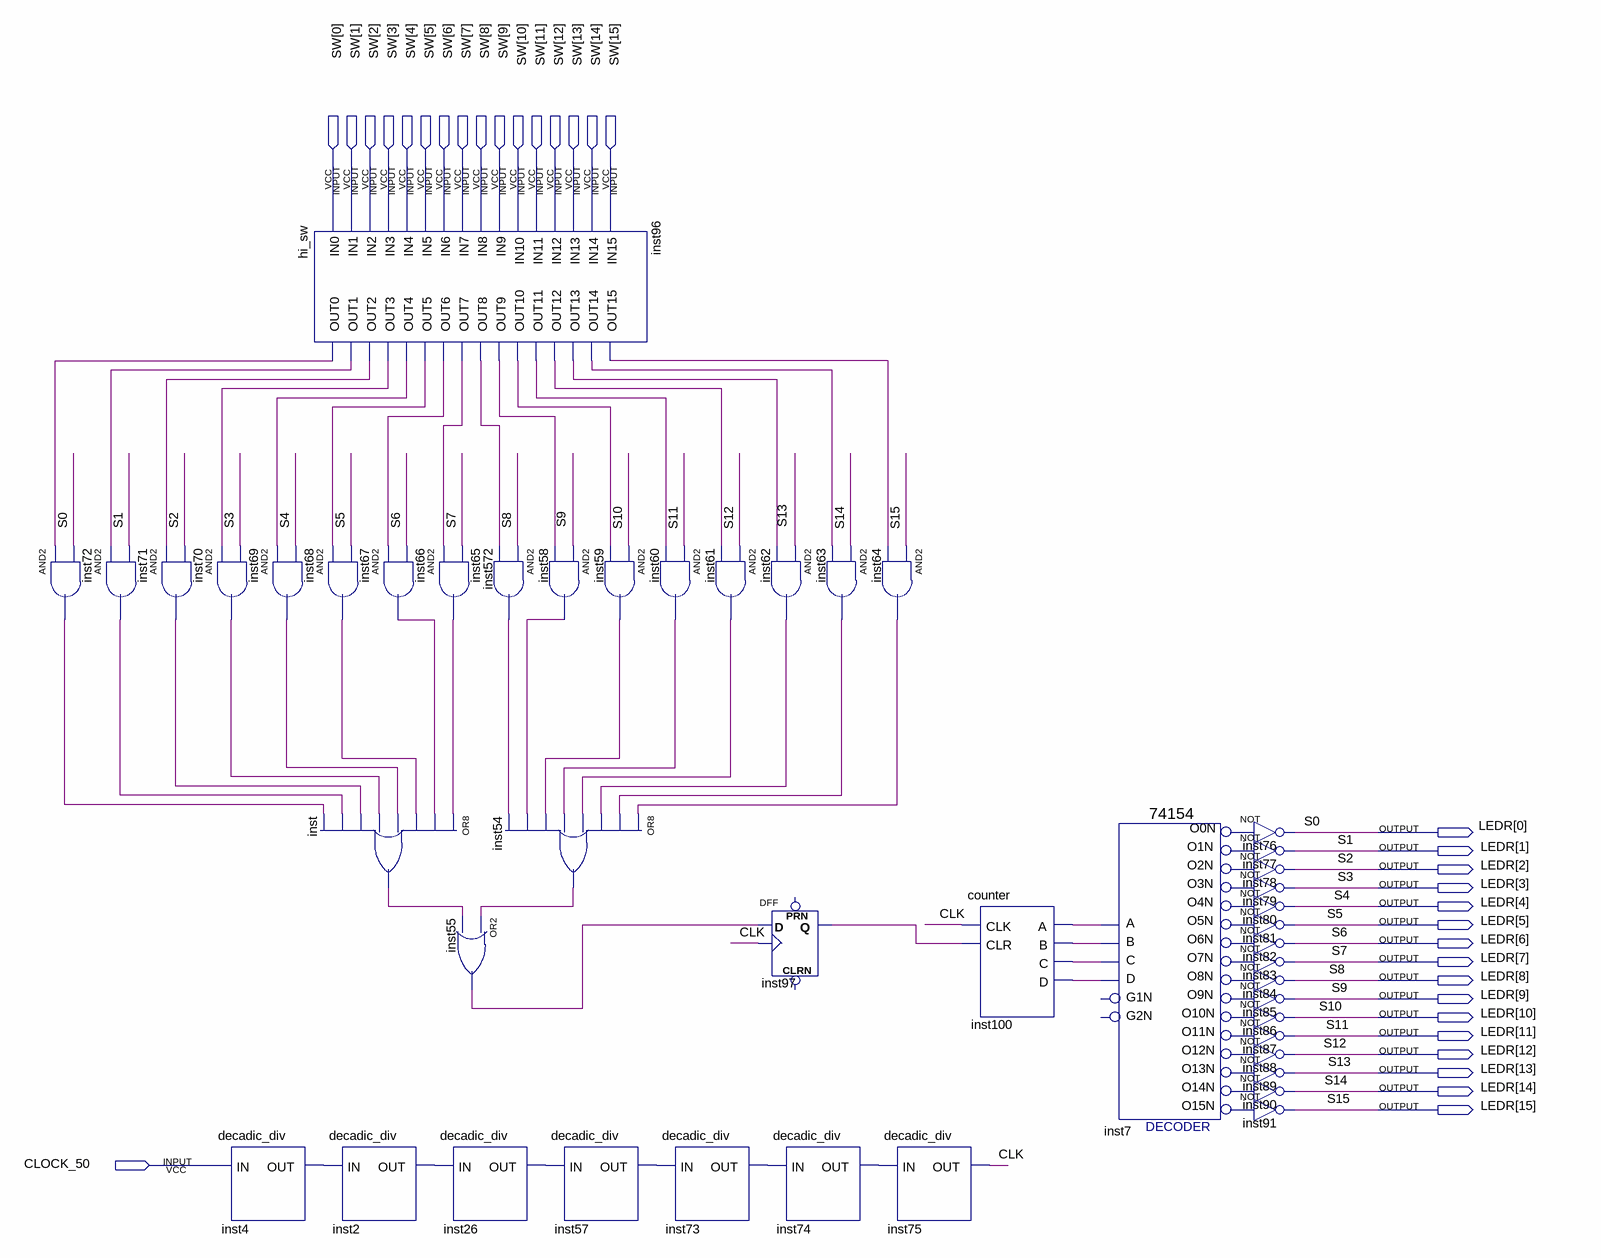
[diagram p0: schematic sheet]
// Quartus schematic had.bdf as structural Verilog: 46 symbols, 33 pins
module had (
  input  [15:0] SW,
  input  CLOCK_50,
  output [15:0] LEDR
);

  wire CLK, inst2_out, inst4_out, inst7_o0n, inst7_o1n, inst7_o2n, inst7_o3n, inst7_o4n, inst7_o5n,
       inst7_o6n, inst7_o7n, inst7_o8n, inst7_o9n, inst7_o10n, inst7_o11n, inst7_o12n, inst7_o13n,
       inst7_o14n, inst7_o15n, inst26_out, inst54_out, inst55_out, inst57_out, inst58_out, inst59_out,
       inst60_out, inst61_out, inst62_out, inst63_out, inst64_out, inst65_out, inst66_out, inst67_out,
       inst68_out, inst69_out, inst70_out, inst71_out, inst72_out, inst73_out, inst74_out, inst96_out0,
       inst96_out1, inst96_out2, inst96_out3, inst96_out4, inst96_out5, inst96_out6, inst96_out7,
       inst96_out8, inst96_out9, inst96_out10, inst96_out11, inst96_out12, inst96_out13, inst96_out14,
       inst96_out15, inst97_q, inst100_a, inst100_b, inst100_c, inst100_d, inst572_out, inst_out;

  and inst71 (inst71_out, inst96_out1, LEDR[1]);
  and inst72 (inst72_out, inst96_out0, LEDR[0]);
  and inst70 (inst70_out, inst96_out2, LEDR[2]);
  and inst69 (inst69_out, inst96_out3, LEDR[3]);
  decadic_div inst4 (.IN(CLOCK_50), .OUT(inst4_out));
  hi_sw inst96 (
    .IN0(SW[0]), .IN1(SW[1]), .IN2(SW[2]), .IN3(SW[3]), .IN4(SW[4]), .IN5(SW[5]), .IN6(SW[6]), .IN7(SW[7]),
    .IN8(SW[8]), .IN9(SW[9]), .IN10(SW[10]), .IN11(SW[11]), .IN12(SW[12]), .IN13(SW[13]), .IN14(SW[14]),
    .IN15(SW[15]), .OUT0(inst96_out0), .OUT1(inst96_out1), .OUT2(inst96_out2), .OUT3(inst96_out3),
    .OUT4(inst96_out4), .OUT5(inst96_out5), .OUT6(inst96_out6), .OUT7(inst96_out7), .OUT8(inst96_out8),
    .OUT9(inst96_out9), .OUT10(inst96_out10), .OUT11(inst96_out11), .OUT12(inst96_out12),
    .OUT13(inst96_out13), .OUT14(inst96_out14), .OUT15(inst96_out15));
  and inst67 (inst67_out, inst96_out5, LEDR[5]);
  and inst68 (inst68_out, inst96_out4, LEDR[4]);
  or inst (inst_out, inst65_out, inst66_out, inst67_out, inst68_out, inst69_out, inst70_out, inst71_out, inst72_out);
  decadic_div inst2 (.IN(inst4_out), .OUT(inst2_out));
  and inst66 (inst66_out, inst96_out6, LEDR[6]);
  and inst65 (inst65_out, inst96_out7, LEDR[7]);
  or inst55 (inst55_out, inst54_out, inst_out);
  decadic_div inst26 (.IN(inst2_out), .OUT(inst26_out));
  and inst58 (inst58_out, LEDR[9], inst96_out9);
  and inst572 (inst572_out, LEDR[8], inst96_out8);
  or inst54 (inst54_out, inst64_out, inst63_out, inst62_out, inst61_out, inst60_out, inst59_out, inst58_out, inst572_out);
  decadic_div inst57 (.IN(inst26_out), .OUT(inst57_out));
  and inst59 (inst59_out, LEDR[10], inst96_out10);
  and inst60 (inst60_out, LEDR[11], inst96_out11);
  decadic_div inst73 (.IN(inst57_out), .OUT(inst73_out));
  and inst61 (inst61_out, LEDR[12], inst96_out12);
  and inst62 (inst62_out, LEDR[13], inst96_out13);
  DFF inst97 (.CLK(CLK), .D(inst55_out), .Q(inst97_q));  // open: CLRN, PRN
  decadic_div inst74 (.IN(inst73_out), .OUT(inst74_out));
  and inst63 (inst63_out, LEDR[14], inst96_out14);
  and inst64 (inst64_out, LEDR[15], inst96_out15);
  decadic_div inst75 (.IN(inst74_out), .OUT(CLK));
  counter inst100 (.CLK(CLK), .CLR(inst97_q), .A(inst100_a), .B(inst100_b), .C(inst100_c), .D(inst100_d));
  \74154  inst7 (
    .C(inst100_c), .D(inst100_d), .B(inst100_b), .A(inst100_a), .O0N(inst7_o0n), .O12N(inst7_o12n),
    .O15N(inst7_o15n), .O10N(inst7_o10n), .O11N(inst7_o11n), .O1N(inst7_o1n), .O13N(inst7_o13n),
    .O14N(inst7_o14n), .O4N(inst7_o4n), .O3N(inst7_o3n), .O2N(inst7_o2n), .O7N(inst7_o7n), .O6N(inst7_o6n),
    .O5N(inst7_o5n), .O9N(inst7_o9n), .O8N(inst7_o8n));  // open: G1N, G2N
  not inst76 (LEDR[0], inst7_o0n);
  not inst77 (LEDR[1], inst7_o1n);
  not inst78 (LEDR[2], inst7_o2n);
  not inst79 (LEDR[3], inst7_o3n);
  not inst80 (LEDR[4], inst7_o4n);
  not inst81 (LEDR[5], inst7_o5n);
  not inst82 (LEDR[6], inst7_o6n);
  not inst83 (LEDR[7], inst7_o7n);
  not inst84 (LEDR[8], inst7_o8n);
  not inst85 (LEDR[9], inst7_o9n);
  not inst86 (LEDR[10], inst7_o10n);
  not inst87 (LEDR[11], inst7_o11n);
  not inst88 (LEDR[12], inst7_o12n);
  not inst89 (LEDR[13], inst7_o13n);
  not inst90 (LEDR[14], inst7_o14n);
  not inst91 (LEDR[15], inst7_o15n);

  // Other names for the same wires on the sheet: S0 = LEDR[0]; S1 = LEDR[1]; S2 = LEDR[2]; S3 = LEDR[3]; S4 = LEDR[4];
  //   S5 = LEDR[5]; S6 = LEDR[6]; S7 = LEDR[7]; S8 = LEDR[8]; S9 = LEDR[9]; S10 = LEDR[10]; S11 = LEDR[11];
  //   S12 = LEDR[12]; S13 = LEDR[13]; S14 = LEDR[14]; S15 = LEDR[15]
endmodule
